# EAGLE design B0_14CN3801 (EAGLE 6.4)
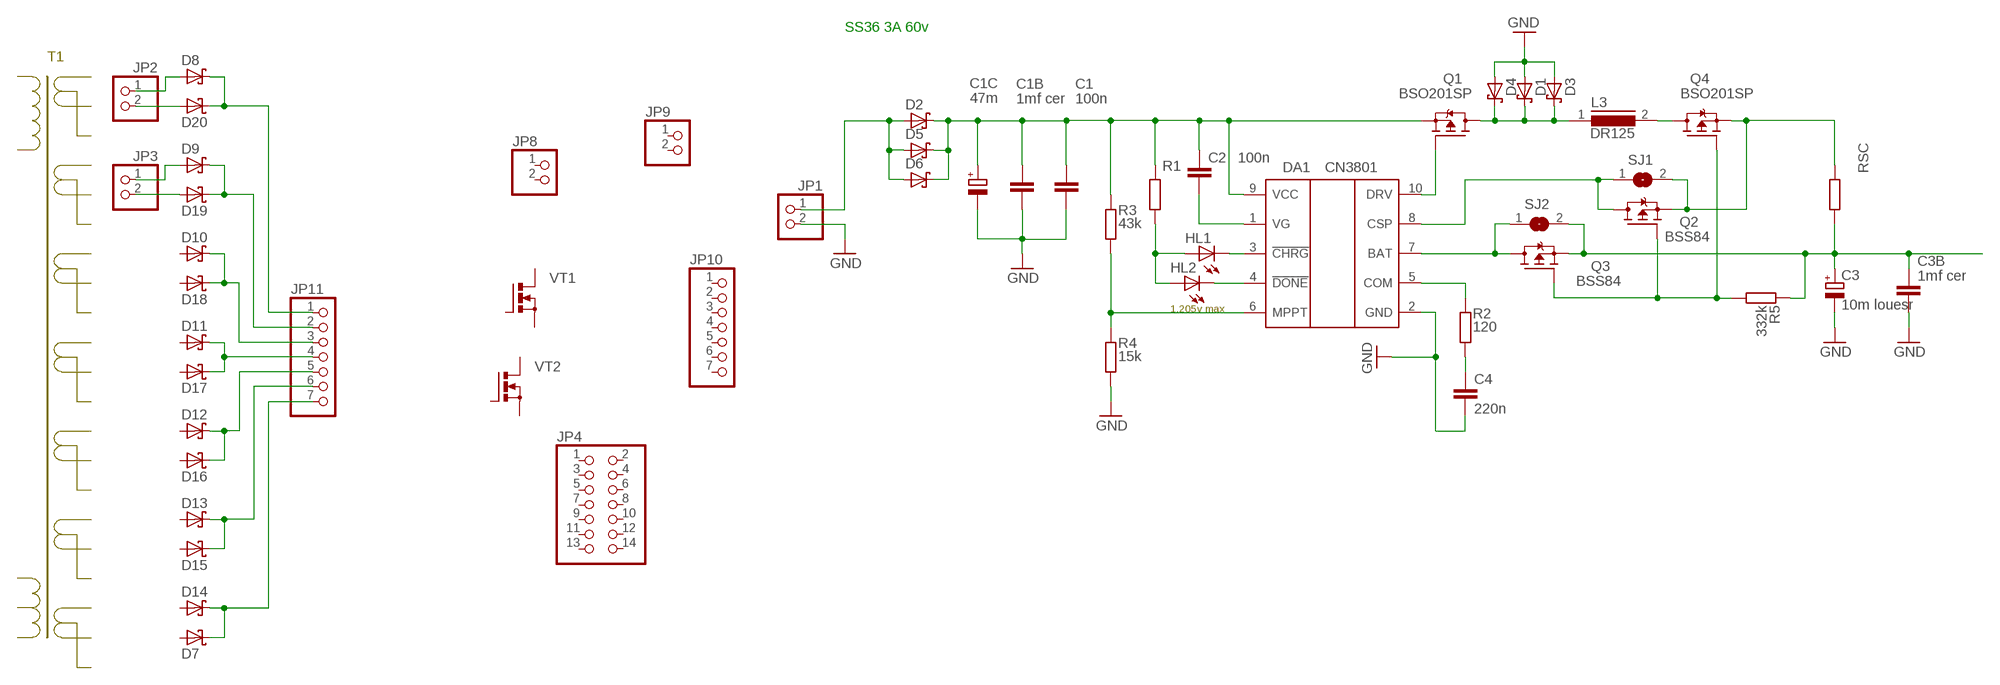
[diagram p0: schematic, sheet 1]

## Parts
C1  100n  C-EUC0805  [C0805]
C1B  1mf cer  C-EUC0805  [C0805]
C1C  47m  CPOL-EUE2.5-6  [E2,5-6]
C2  100n  C-EUC0805  [C0805]
C3  10m louesr  CPOL-EUE2.5-6  [E2,5-6]
C3B  1mf cer  C-EUC0805  [C0805]
C4  220n  C-EUC0805  [C0805]
D1  SCHOTTKY-DIODESMC  [SMC]
D2  SCHOTTKY-DIODESMC  [SMC]
D3  SCHOTTKY-DIODESMC  [SMC]
D4  SCHOTTKY-DIODESMC  [SMC]
D5  SCHOTTKY-DIODESMC  [SMC]
D6  SCHOTTKY-DIODESMC  [SMC]
D7  SCHOTTKY-DIODESMC  [SMC]
D8  SCHOTTKY-DIODESMC  [SMC]
D9  SCHOTTKY-DIODESMC  [SMC]
D10  SCHOTTKY-DIODESMC  [SMC]
D11  SCHOTTKY-DIODESMC  [SMC]
D12  SCHOTTKY-DIODESMC  [SMC]
D13  SCHOTTKY-DIODESMC  [SMC]
D14  SCHOTTKY-DIODESMC  [SMC]
D15  SCHOTTKY-DIODESMC  [SMC]
D16  SCHOTTKY-DIODESMC  [SMC]
D17  SCHOTTKY-DIODESMC  [SMC]
D18  SCHOTTKY-DIODESMC  [SMC]
D19  SCHOTTKY-DIODESMC  [SMC]
D20  SCHOTTKY-DIODESMC  [SMC]
DA1  CN3801  [SSOP10]
HL1  LEDCHIPLED_0603  [CHIPLED_0603]
HL2  LEDCHIPLED_0603  [CHIPLED_0603]
JP1  PINHD-1X2/2  [1X02]
JP2  PINHD-1X2/2  [1X02]
JP3  PINHD-1X2/2  [1X02]
JP4  PINHD-2X7  [2X07]
JP8  PINHD-1X2/2  [1X02]
JP9  PINHD-1X2/2  [1X02]
JP10  PINHD-1X7  [1X07]
JP11  PINHD-1X7  [1X07]
L3  DR125  [DR125]
Q1  BSO201SP  [SO-8]
Q2  BSS84  BSA223SP  [SC75_INFINEON]
Q3  BSS84  BSA223SP  [SC75_INFINEON]
Q4  BSO201SP  [SO-8]
R1  R-EU_R0805  [R0805]
R2  120  R-EU_R0805  [R0805]
R3  43k  R-EU_R0805  [R0805]
R4  15k  R-EU_R0805  [R0805]
R5  332k  R-EU_R0805  [R0805]
RSC  R-EU_R0805  [R0805]
SJ1  SJ  [SJ]
SJ2  SJ  [SJ]
VT1  MOSFET-N_TO220_H  [TO220BH]
VT2  MOSFET-N_TO220_H  [TO220BH]

## Nets
BAT: DA1.7(BAT) Q3.2(D) SJ2.1
COM: DA1.5(COM) R2.2
CSP: DA1.8(CSP) Q2.2(D) SJ1.1
GND: C1.2 C1B.2 C1C.- C3.- C3B.2 C4.2 D1.A D3.A D4.A DA1.2(GND) JP1.2 R4.1
N$1: C1.1 C1B.1 C1C.+ C2.1 D2.C D5.C D6.C DA1.9(VCC) Q1.1(S) Q1.2(S) Q1.3(S) R1.2 R3.2
N$2: C2.2 DA1.1(VG)
N$3: DA1.6(MPPT) R3.1 R4.2
N$4: D2.A D5.A D6.A JP1.1
N$5: HL1.A HL2.A R1.1
N$6: DA1.3(!CHRG) HL1.C
N$7: DA1.4(!DONE) HL2.C
N$8: C4.1 R2.1
N$9: DA1.10(DRV) Q1.4(G)
N$10: D7.C D14.C JP11.7
N$11: L3.2 Q4.5(D) Q4.6(D) Q4.7(D) Q4.8(D)
N$12: Q2.1(G) Q3.1(G) Q4.4(G) R5.1
N$13: D1.C D3.C D4.C L3.1 Q1.5(D) Q1.6(D) Q1.7(D) Q1.8(D)
N$14: Q2.3(S) Q4.1(S) Q4.2(S) Q4.3(S) RSC.2 SJ1.2
N$15: C3.+ C3B.1 Q3.3(S) R5.2 RSC.1 SJ2.2
N$16: D13.C D15.C JP11.6
N$17: D12.C D16.C JP11.5
N$18: D11.C D17.C JP11.4
N$19: D10.C D18.C JP11.3
N$20: D9.C D19.C JP11.2
N$21: D8.C D20.C JP11.1
N$22: D19.A JP3.2
N$23: D9.A JP3.1
N$24: D8.A JP2.1
N$25: D20.A JP2.2
Unconnected: D7.A D10.A D11.A D12.A D13.A D14.A D15.A D16.A D17.A D18.A JP4.1 JP4.2 JP4.3 JP4.4 JP4.5 JP4.6 JP4.7 JP4.8 JP4.9 JP4.10 JP4.11 JP4.12 JP4.13 JP4.14 JP8.1 JP8.2 JP9.1 JP9.2 JP10.1 JP10.2 JP10.3 JP10.4 JP10.5 JP10.6 JP10.7 VT1.D VT1.G VT1.S VT2.D VT2.G VT2.S

## Notes on the sheet
- SS36 3A 60v
- T1
- 1.205v max

## Library data of the parts
C1 C1B C2 C3B C4 = rcl:C-EU: CAPACITOR, European symbol
C1C C3 = rcl:CPOL-EU: POLARIZED CAPACITOR, European symbol
D1-D20 = diode:SCHOTTKY-DIODE: Schottky Diode
DA1 = Consonance:CN3801
HL1 HL2 = led:LED: LED OSRAM: - CHIPLED LG R971, LG N971, LY N971, LG Q971, LY Q971, LO R971, LY R971 LH N974, LH R974 LS Q976, LO Q976, LY Q976 LO Q996 - Hyper CHIPLED LW Q18S LB Q993, LB Q99A, LB R99A - SideLED LS A670, LO A670, LY A670, LG A670, LP A670 LB A673, LV A673, LT A673, LW A673 LH A674 LY A675 LS A676, LA A676, LO A676, LY A676, LW A676 LS A679, LY A679, LG A679 - Hyper Micro SIDELED® LS Y876, LA Y876, LO Y876, LY Y876 LT Y87S - SmartLED LW L88C, LW L88S LB L89C, LB L89S, LG L890 LS L89K, LO L89K, LY L89K LS L896, LA L896, LO L896, LY L896 - TOPLED LS T670, LO T670, LY T670, LG T670, LP T670 LSG T670, LSP T670, LSY T670, LOP T670, LYG T670 LG T671, LOG T671, LSG T671 LB T673, LV T673, LT T673, LW T673 LH T674 LS T676, LA T676, LO T676, LY T676, LB T676, LH T676, LSB T676, LW T676 LB T67C, LV T67C, LT T67C, LS T67K, LO T67K, LY T67K, LW E67C LS E67B, LA E67B, LO E67B, LY E67B, LB E67C, LV E67C, LT E67C LW T67C LS T679, LY T679, LG T679 LS T770, LO T770, LY T770, LG T770, LP T770 LB T773, LV T773, LT T773, LW T773 LH T774 LS E675, LA E675, LY E675, LS T675 LS T776, LA T776, LO T776, LY T776, LB T776 LHGB T686 LT T68C, LB T68C - Hyper Mini TOPLED® LB M676 - Mini TOPLED Santana® LG M470 LS M47K, LO M47K, LY M47K Source: http://www.osram.convergy.de LUXEON: - LUMILED® LXK2-PW12-R00, LXK2-PW12-S00, LXK2-PW14-U00, LXK2-PW14-V00 LXK2-PM12-R00, LXK2-PM12-S00, LXK2-PM14-U00 LXK2-PE12-Q00, LXK2-PE12-R00, LXK2-PE12-S00, LXK2-PE14-T00, LXK2-PE14-U00 LXK2-PB12-K00, LXK2-PB12-L00, LXK2-PB12-M00, LXK2-PB14-N00, LXK2-PB14-P00, LXK2-PB14-Q00 LXK2-PR12-L00, LXK2-PR12-M00, LXK2-PR14-Q00, LXK2-PR14-R00 LXK2-PD12-Q00, LXK2-PD12-R00, LXK2-PD12-S00 LXK2-PH12-R00, LXK2-PH12-S00 LXK2-PL12-P00, LXK2-PL12-Q00, LXK2-PL12-R00 Source: www.luxeon.com KINGBRIGHT: KA-3528ASYC Source: www.kingbright.com
JP1-JP3 JP8 JP9 = Разъёмы штырьковые 2.54мм:PINHD-1X2: PIN HEADER
JP4 = Разъёмы штырьковые 2.54мм:PINHD-2X7: PIN HEADER
JP10 JP11 = Разъёмы штырьковые 2.54мм:PINHD-1X7: PIN HEADER
L3 = inductors:DR125: High Power Density, High Efficiency, Shielded Inductors Source: coiltronics_dr_series.pdf
Q1 Q4 = transistor-fet:BSO201SP: OptiMOS(R)-P Small-Signal-Transistor P-Channel, Enhancement mode, Super Logic Level (2.5 V rated) RDS(on) 8mOhm, ID -14.9 a Source: http://www.infineon.com/upload/Document/cmc_upload/documents/011/3655/BSO201SP_211201.pdf
Q2 Q3 = transistor-fet:BSA223SP: OptiMOS(R)-P Small-Signal-Transistor P-Channel, Enhancement mode, Super Logic Level (2.5 V rated) Source: http://www.infineon.com/upload/Document/BSA223SP_Rev1.3.pdf
R1-R5 RSC = rcl:R-EU_: RESISTOR, European symbol
SJ1 SJ2 = jumper:SJ: SMD solder JUMPER
VT1 VT2 = m_transistor:MOSFET-N: MOSFET N-Channel

## Board
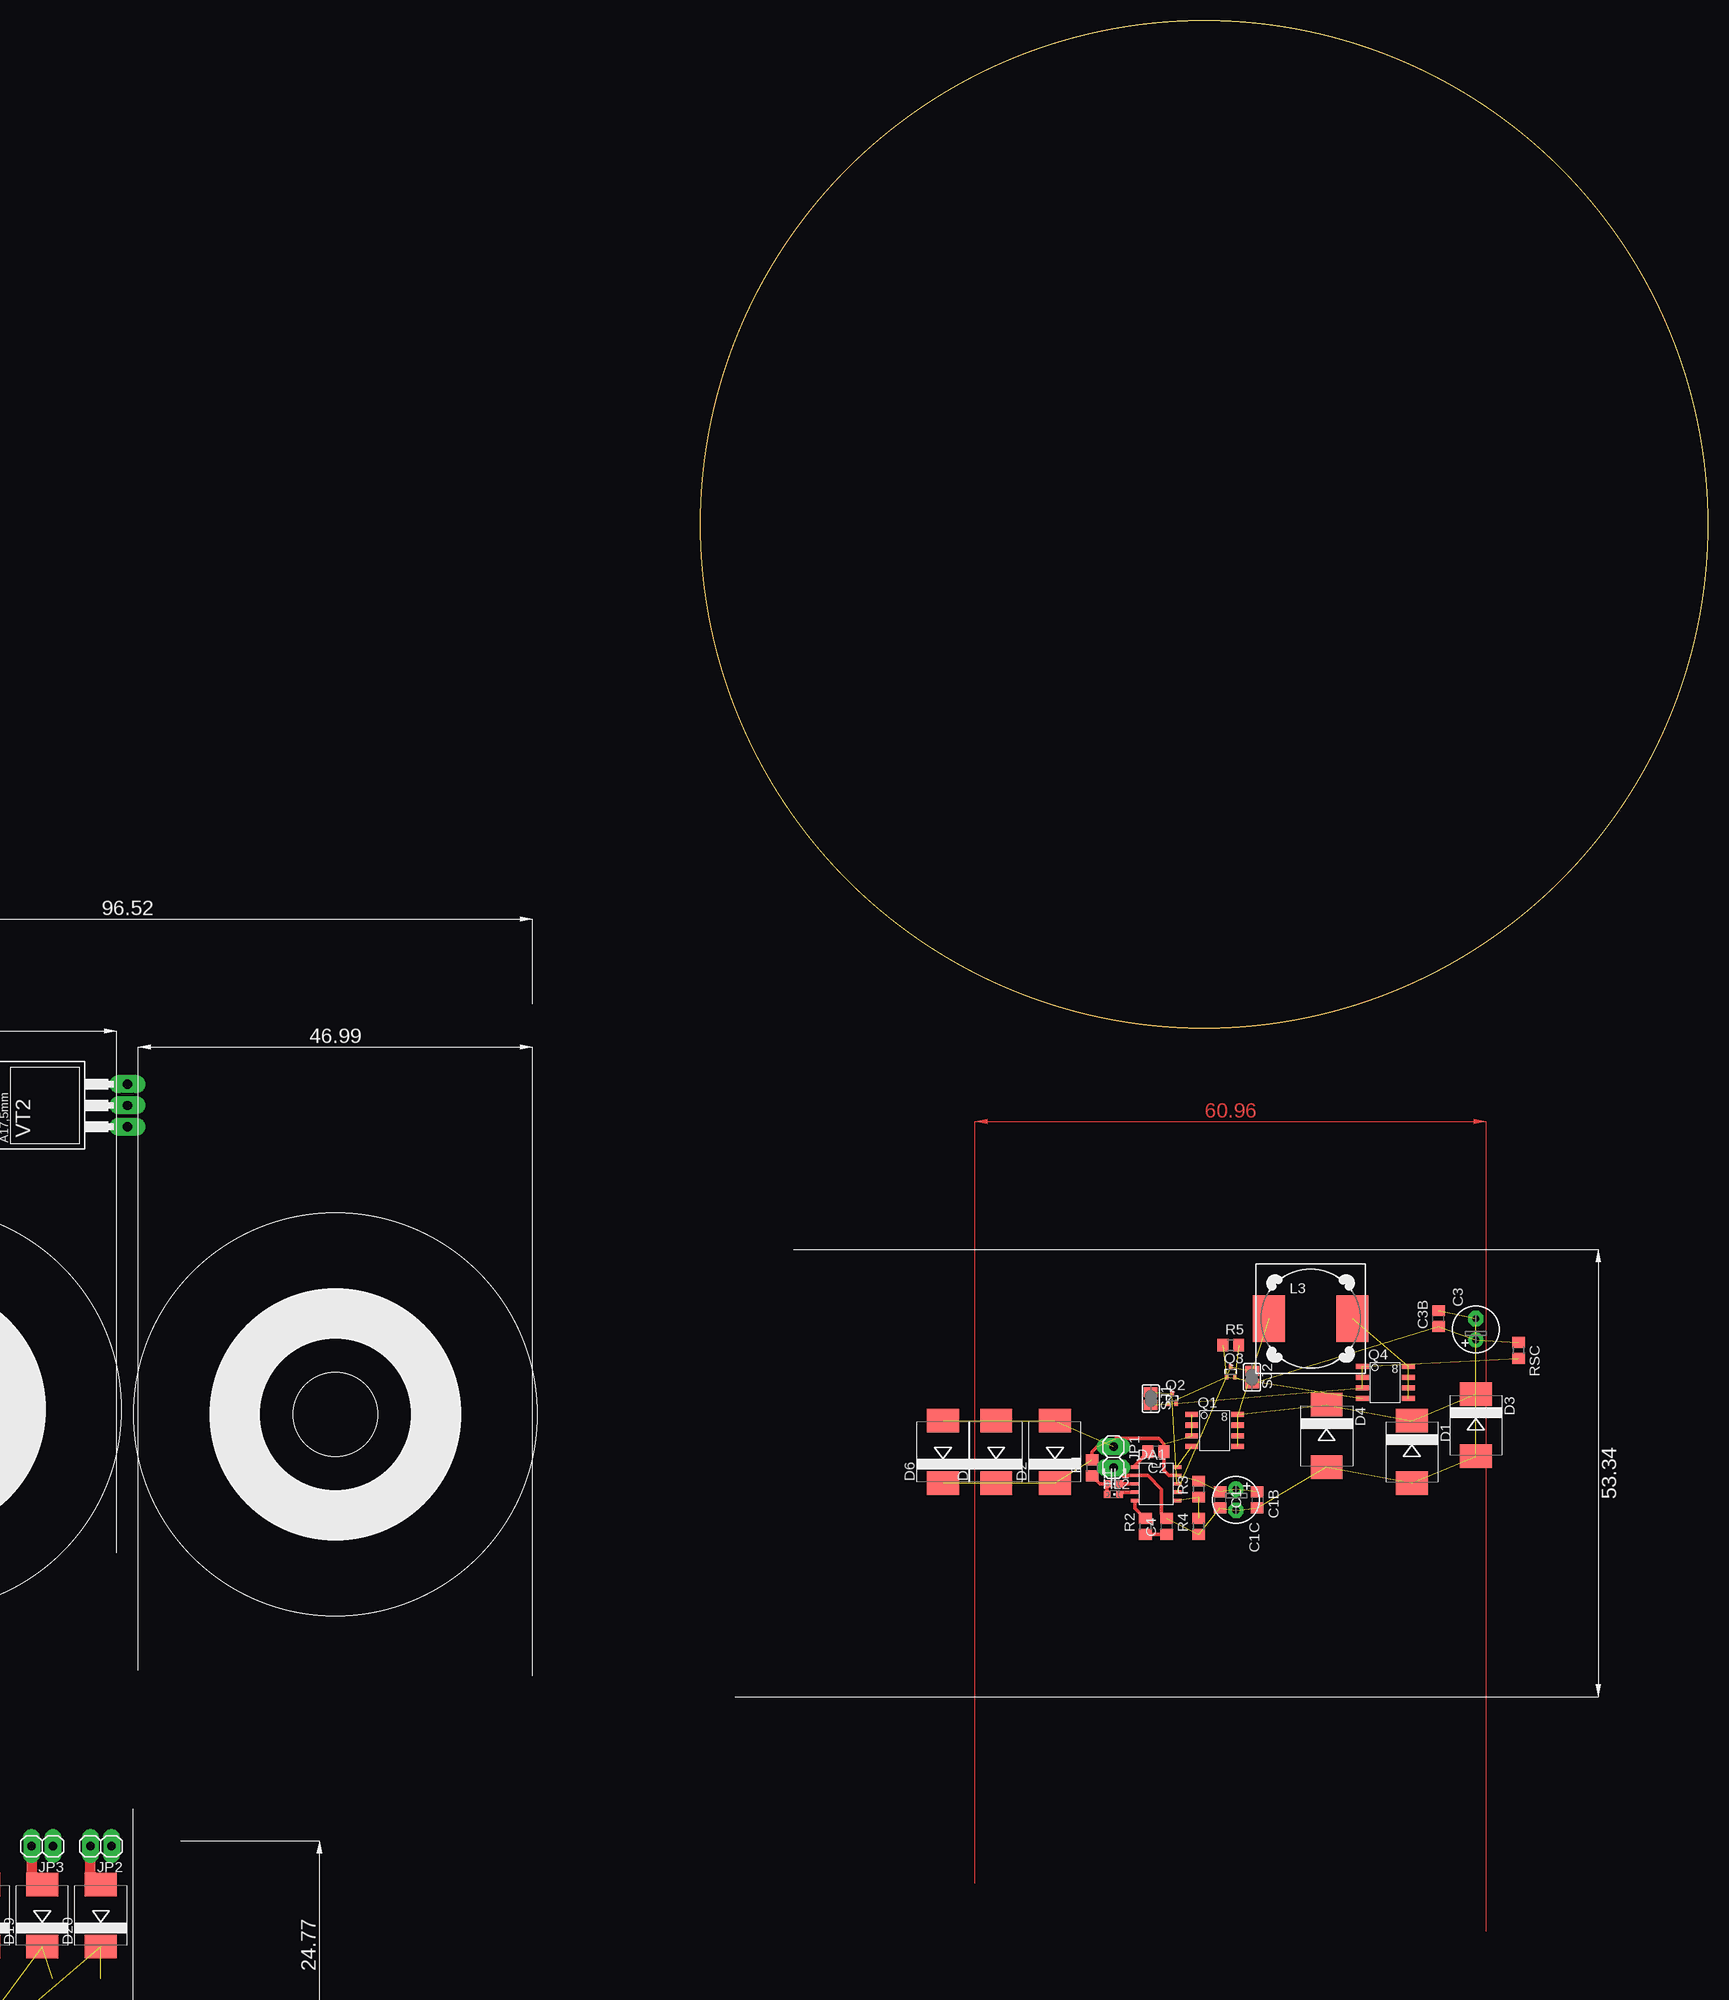
[diagram p1: board, top side]
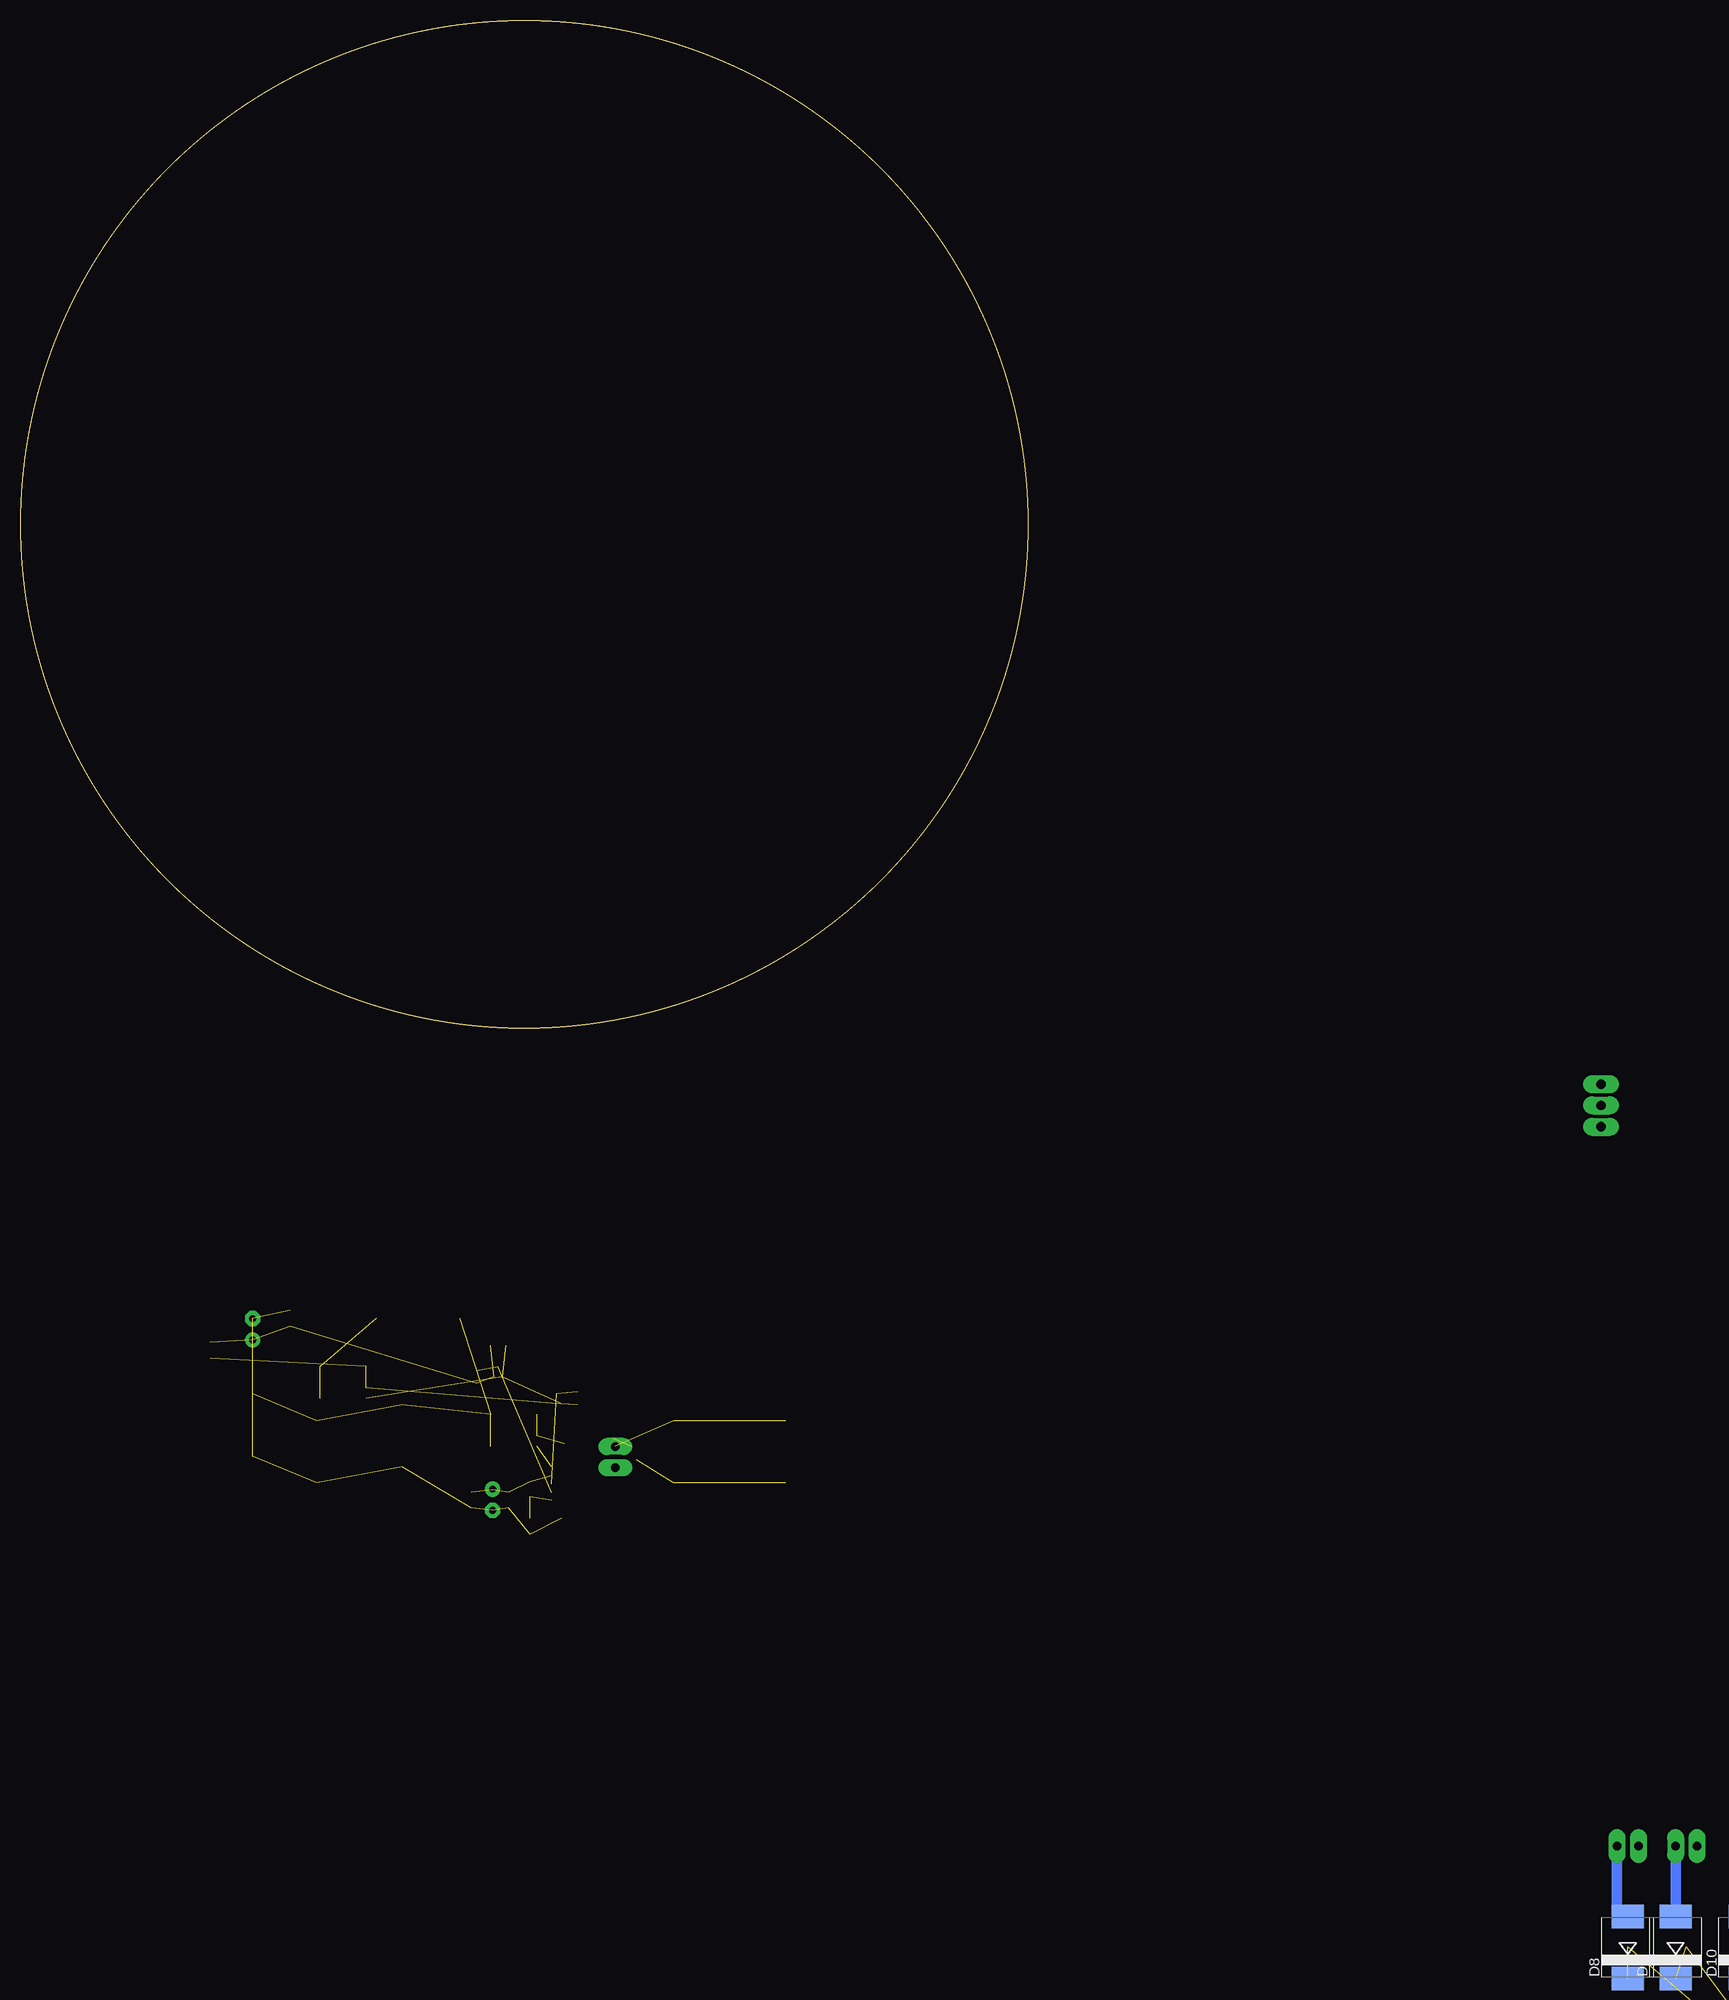
[diagram p2: board, bottom side, seen from below]

Size 120 x 120 mm. Coordinates in mm from the lower left corner, seen from the top.
Copper layers (1*16): Top 0.035mm / dielectric 1.5mm / Bottom 0.035mm
Design rules "DesignRules": minimum track width 8mil, minimum drill 24mil, track to track 0.2mm, track to pad 0.2mm, pad to pad 8mil, via to via 8mil, smd to smd 8mil, copper to edge 10mil, drill to drill 8mil, minimum pad ring 0.5mm, minimum via ring 8mil, stop-mask expansion 4mil, vias tented up to drill 0mil, thermal gap 10mil

### Footprints (pad centres in the part's own frame; a part is rotated, then mirrored left to right if it is on the bottom)
C0805 = smd 1.3 x 1.5: 1 -0.95,0; 2 0.95,0
E2,5-6 = drill 0.813 pad 1.6: + -1.27,0 | drill 0.813 pad 1.6 octagon: - 1.27,0
SMC = smd 2.8 x 3.8: A 3.7,0; C -3.7,0
SSOP10 = smd 1 x 0.4: 1 -2.5,2; 2 -2.5,1; 3 -2.5,0; 4 -2.5,-1; 5 -2.5,-2; 6 2.5,-2; 7 2.5,-1; 8 2.5,0; 9 2.5,1; 10 2.5,2
CHIPLED_0603 = smd 0.8 x 0.8: A 0,-0.75; C 0,0.75
1X02 = drill 1.016 long: 1 -1.27,0; 2 1.27,0
2X07 = drill 1.016 octagon: 1 -7.62,-1.27; 2 -7.62,1.27; 3 -5.08,-1.27; 4 -5.08,1.27; 5 -2.54,-1.27; 6 -2.54,1.27; 7 0,-1.27; 8 0,1.27; 9 2.54,-1.27; 10 2.54,1.27; 11 5.08,-1.27; 12 5.08,1.27; 13 7.62,-1.27; 14 7.62,1.27
1X07 = drill 1.016 long: 1 -7.62,0; 2 -5.08,0; 3 -2.54,0; 4 0,0; 5 2.54,0; 6 5.08,0; 7 7.62,0
DR125 = smd 3.85 x 5.5: 1 -4.975,0; 2 4.975,0
SO-8 = smd 1.524 x 0.61: 1 -2.743,1.905; 2 -2.743,0.635; 3 -2.743,-0.635; 4 -2.743,-1.905; 5 2.743,-1.905; 6 2.743,-0.635; 7 2.743,0.635; 8 2.743,1.905
SC75_INFINEON = smd 0.4 x 0.65: 1 -0.5,-0.575; 2 0,0.575; 3 0.5,-0.575
R0805 = smd 1.3 x 1.5: 1 -0.95,0; 2 0.95,0
SJ = smd 1.168 x 1.6: 1 -0.762,0; 2 0.762,0
TO220BH = drill 1.118 long: D 0,-6.35; G -2.54,-6.35; S 2.54,-6.35 | hole 3.302: 0,11.176

### Placement (x,y rotation side)
C1  61.91,-56.2 270 top  (outside the outline)
C1B  66.35,-56.2 270 top  (outside the outline)
C1C  63.81,-56.2 270 top  (outside the outline)
C2  54.29,-50.49 180 top  (outside the outline)
C3  92.39,-35.89 90 top  (outside the outline)
C3B  87.94,-34.61 90 top  (outside the outline)
C4  55.56,-59.38 90 top  (outside the outline)
D1  84.77,-50.49 270 top  (outside the outline)
D2  42.22,-50.49 90 top  (outside the outline)
D3  92.39,-47.31 270 top  (outside the outline)
D4  74.61,-48.58 270 top  (outside the outline)
D5  35.24,-50.49 90 top  (outside the outline)
D6  28.89,-50.49 90 top  (outside the outline)
D7  -113.35,-105.73 90 top  (outside the outline)
D8  -71.44,-109.55 90 bottom  (outside the outline)
D9  -77.16,-109.55 90 bottom  (outside the outline)
D10  -85.41,-109.55 90 bottom  (outside the outline)
D11  -92.4,-109.55 90 bottom  (outside the outline)
D12  -99.38,-109.55 90 bottom  (outside the outline)
D13  -106.37,-109.55 90 bottom  (outside the outline)
D14  -113.35,-109.55 90 bottom  (outside the outline)
D15  -106.37,-105.73 90 top  (outside the outline)
D16  -99.38,-105.73 90 top  (outside the outline)
D17  -92.4,-105.73 90 top  (outside the outline)
D18  -85.41,-105.73 90 top  (outside the outline)
D19  -78.43,-105.73 90 top  (outside the outline)
D20  -71.44,-105.73 90 top  (outside the outline)
DA1  54.29,-54.3 0 top  (outside the outline)
HL1  49.21,-54.3 270 top  (outside the outline)
HL2  49.21,-55.57 270 top  (outside the outline)
JP1  49.21,-51.12 270 top  (outside the outline)
JP2  -71.44,-97.48 180 top  (outside the outline)
JP3  -78.43,-97.48 180 top  (outside the outline)
JP4  -133.68,-74.62 0 top  (outside the outline)
JP8  -100.02,-19.38 0 top  (outside the outline)
JP9  -88.59,-18.74 0 top  (outside the outline)
JP10  -119.7,-63.19 90 top  (outside the outline)
JP11  -91.13,-119.7 180 top  (outside the outline)
L3  72.7,-34.61 0 top  (outside the outline)
Q1  61.27,-47.95 0 top  (outside the outline)
Q2  56.19,-44.14 0 top  (outside the outline)
Q3  63.18,-40.97 0 top  (outside the outline)
Q4  81.59,-42.23 0 top  (outside the outline)
R1  46.67,-52.39 90 top  (outside the outline)
R2  53.02,-59.38 90 top  (outside the outline)
R3  59.37,-54.94 90 top  (outside the outline)
R4  59.37,-59.38 90 top  (outside the outline)
R5  63.18,-37.79 0 top  (outside the outline)
RSC  97.47,-38.42 270 top  (outside the outline)
SJ1  53.65,-44.14 270 top  (outside the outline)
SJ2  65.72,-41.6 270 top  (outside the outline)
U$1  [PCB1]  60,60 0 top
U$2  [T48K30]  -93.03,-45.41 0 top  (outside the outline)
U$3  [T48K30]  -43.5,-46.05 0 top  (outside the outline)
VT1  -100.02,-9.22 90 top  (outside the outline)
VT2  -74.62,-9.22 90 top  (outside the outline)

### Tracks (layer width: path | path; a pad name or v marks a point on that pad's centre or on a via)
BAT  (2 unrouted)
COM
  Top 0.406: DA1.5 51.79,-57.2 R2.2
CSP  (2 unrouted)
GND  (9 unrouted)
  Top 0.406: C4.2 54.92,-57.8 54.92,-54.94 53.29,-53.3 DA1.2 50.11,-53.3 JP1.2
N$1  (11 unrouted)
  Top 0.406: 47.3,-49.85 46.67,-50.49 R1.2 | DA1.9 55.83,-53.3 55.24,-52.71 C2.1 55.24,-49.53 54.61,-48.91 49.52,-48.91
N$2
  Top 0.406: DA1.1 51.75,-52.26 51.75,-52.08 C2.2
N$3  (2 unrouted)
N$4  (3 unrouted)
N$5
  Top 0.406: HL2.A HL1.A 47.62,-54.3 R1.1
N$6
  Top 0.406: HL1.C DA1.3
N$7
  Top 0.406: DA1.4 50.23,-55.3 HL2.C
N$8
  Top 0.406: R2.1 C4.1
N$9  (1 unrouted)
N$10  (2 unrouted)
N$11  (4 unrouted)
N$12  (3 unrouted)
N$13  (7 unrouted)
N$14  (5 unrouted)
N$15  (5 unrouted)
N$16  (2 unrouted)
N$17  (2 unrouted)
N$18  (2 unrouted)
N$19  (2 unrouted)
N$20  (2 unrouted)
N$21  (2 unrouted)
N$22
  Top 1.27: JP3.2 -79.7,-100.77 D19.A
N$23
  Bottom 1.27: D9.A JP3.1
N$24
  Bottom 1.27: D8.A -70.17,-104.58 JP2.1
N$25
  Top 1.27: JP2.2 -72.71,-100.77 D20.A
(copper drawn outside any net)
  shapes: Top area x1